# EAGLE schematic BD0006_1 (digit) (EAGLE 9.6.2)
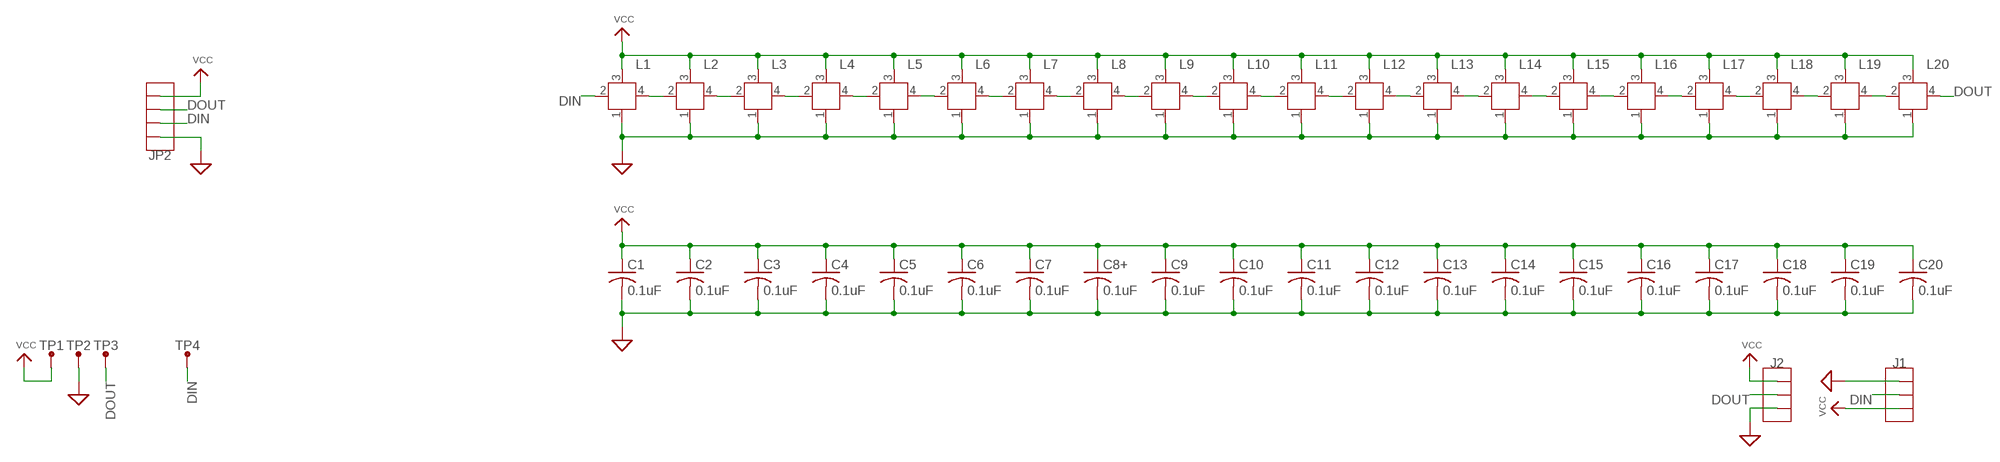
[diagram p0: schematic, sheet 1]

## Parts
C1  0.1uF  C-USC0402  [C0402]
C2  0.1uF  C-USC0402  [C0402]
C3  0.1uF  C-USC0402  [C0402]
C4  0.1uF  C-USC0402  [C0402]
C5  0.1uF  C-USC0402  [C0402]
C6  0.1uF  C-USC0402  [C0402]
C7  0.1uF  C-USC0402  [C0402]
C8+  0.1uF  C-USC0402  [C0402]
C9  0.1uF  C-USC0402  [C0402]
C10  0.1uF  C-USC0402  [C0402]
C11  0.1uF  C-USC0402  [C0402]
C12  0.1uF  C-USC0402  [C0402]
C13  0.1uF  C-USC0402  [C0402]
C14  0.1uF  C-USC0402  [C0402]
C15  0.1uF  C-USC0402  [C0402]
C16  0.1uF  C-USC0402  [C0402]
C17  0.1uF  C-USC0402  [C0402]
C18  0.1uF  C-USC0402  [C0402]
C19  0.1uF  C-USC0402  [C0402]
C20  0.1uF  C-USC0402  [C0402]
J1  HEADER_1X3MALE  [M3SMD]
J2  HEADER_1X3FEMALE  [F3SMD]
JP2  HEADER_1X4S  [1X04]
L1  WS2812B  [SK6812]
L2  WS2812B  [SK6812]
L3  WS2812B  [SK6812]
L4  WS2812B  [SK6812]
L5  WS2812B  [SK6812]
L6  WS2812B  [SK6812]
L7  WS2812B  [SK6812]
L8  WS2812B  [SK6812]
L9  WS2812B  [SK6812]
L10  WS2812B  [SK6812]
L11  WS2812B  [SK6812]
L12  WS2812B  [SK6812]
L13  WS2812B  [SK6812]
L14  WS2812B  [SK6812]
L15  WS2812B  [SK6812]
L16  WS2812B  [SK6812]
L17  WS2812B  [SK6812]
L18  WS2812B  [SK6812]
L19  WS2812B  [SK6812]
L20  WS2812B  [SK6812]
TP1  VCC  TEST_POINT  [TEST_POINT]
TP2  GND  TEST_POINT  [TEST_POINT]
TP3  DOUT  TEST_POINT  [TEST_POINT]
TP4  DIN  TEST_POINT  [TEST_POINT]

## Nets
DIN: J1.2 JP2.2 L1.2(DIN) TP4.P$1
DOUT: J2.2A J2.2B JP2.3 L20.4(DOUT) TP3.P$1
GND: C1.2 C2.2 C3.2 C4.2 C5.2 C6.2 C7.2 C8+.2 C9.2 C10.2 C11.2 C12.2 C13.2 C14.2 C15.2 C16.2 C17.2 C18.2 C19.2 C20.2 J1.1 J2.3A J2.3B JP2.1 L1.1(VSS) L2.1(VSS) L3.1(VSS) L4.1(VSS) L5.1(VSS) L6.1(VSS) L7.1(VSS) L8.1(VSS) L9.1(VSS) L10.1(VSS) L11.1(VSS) L12.1(VSS) L13.1(VSS) L14.1(VSS) L15.1(VSS) L16.1(VSS) L17.1(VSS) L18.1(VSS) L19.1(VSS) L20.1(VSS) TP2.P$1 ; supply symbol labelled SUP
N$8: L19.4(DOUT) L20.2(DIN)
N$9: L18.4(DOUT) L19.2(DIN)
N$10: L17.4(DOUT) L18.2(DIN)
N$11: L16.4(DOUT) L17.2(DIN)
N$12: L15.4(DOUT) L16.2(DIN)
N$13: L14.4(DOUT) L15.2(DIN)
N$14: L13.4(DOUT) L14.2(DIN)
N$15: L12.4(DOUT) L13.2(DIN)
N$16: L11.4(DOUT) L12.2(DIN)
N$17: L10.4(DOUT) L11.2(DIN)
N$18: L9.4(DOUT) L10.2(DIN)
N$19: L8.4(DOUT) L9.2(DIN)
N$20: L7.4(DOUT) L8.2(DIN)
N$21: L1.4(DOUT) L2.2(DIN)
N$22: L2.4(DOUT) L3.2(DIN)
N$23: L3.4(DOUT) L4.2(DIN)
N$24: L4.4(DOUT) L5.2(DIN)
N$25: L5.4(DOUT) L6.2(DIN)
N$26: L6.4(DOUT) L7.2(DIN)
VCC: C1.1 C2.1 C3.1 C4.1 C5.1 C6.1 C7.1 C8+.1 C9.1 C10.1 C11.1 C12.1 C13.1 C14.1 C15.1 C16.1 C17.1 C18.1 C19.1 C20.1 J1.3 J2.1A J2.1B JP2.4 L1.3(VDD) L2.3(VDD) L3.3(VDD) L4.3(VDD) L5.3(VDD) L6.3(VDD) L7.3(VDD) L8.3(VDD) L9.3(VDD) L10.3(VDD) L11.3(VDD) L12.3(VDD) L13.3(VDD) L14.3(VDD) L15.3(VDD) L16.3(VDD) L17.3(VDD) L18.3(VDD) L19.3(VDD) L20.3(VDD) TP1.P$1

## Library data of the parts
C1-C7 C8+ C9-C20 = adafruit:C-US: CAPACITOR, American symbol
J1 J2 = Clock:HEADER_1X3
JP2 = Clock:HEADER_1X4S
L1-L20 = Clock:WS2812B
TP1-TP4 = Clock:TEST_POINT